# EAGLE design CamLight (EAGLE 9.4.2)
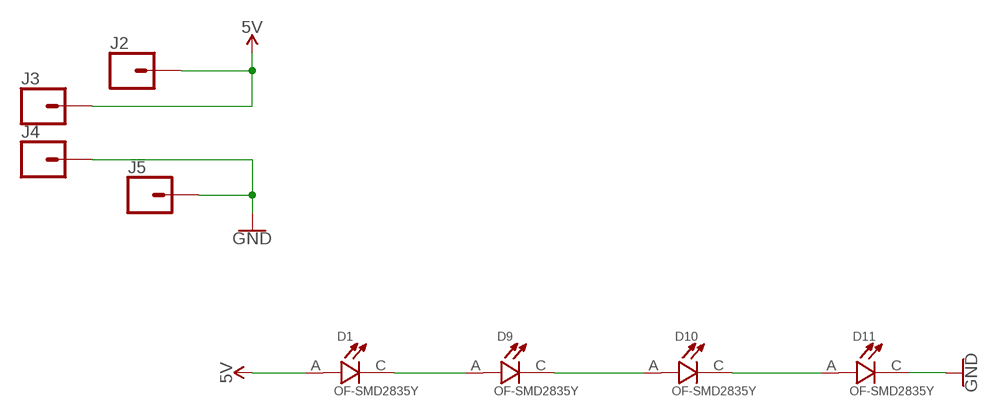
[diagram p0: schematic, sheet 1]

## Parts
D1  OF-SMD2835Y  [LED_OF-SMD2835Y]
D9  OF-SMD2835Y  [LED_OF-SMD2835Y]
D10  OF-SMD2835Y  [LED_OF-SMD2835Y]
D11  OF-SMD2835Y  [LED_OF-SMD2835Y]
J2  CONN_01  [1X01]
J3  CONN_01  [1X01]
J4  CONN_01  [1X01]
J5  CONN_01  [1X01]

## Nets
5V: D1.A J2.1 J3.1
GND: D11.C J4.1 J5.1
N$1: D10.C D11.A
N$9: D9.C D10.A
N$10: D1.C D9.A

## Library data of the parts
D1 D9-D11 = OF-SMD2835Y:OF-SMD2835Y: LED; SMD; 2835, PLCC2; yellow; 2200-2800mcd; 2.8x3.5x0.75mm; 120° Check availability <https://pricing.snapeda.com/parts/OF-SMD2835Y/Optoflash/view-part?ref=eda>; AVAILABILITY: Not in stock; CHECK_PRICES: https://www.snapeda.com/parts/OF-SMD2835Y/Optoflash/view-part/?ref=eda; DESCRIPTION: LED; SMD; 2835, PLCC2; yellow; 2200-2800mcd; 2.8x3.5x0.75mm; 120°; MF: Optoflash; MP: OF-SMD2835Y; PACKAGE: PLCC-2 Optoflash; PRICE: None; SNAPEDA_LINK: https://www.snapeda.com/parts/OF-SMD2835Y/Optoflash/view-part/?ref=snap
J2-J5 = SparkFun-Connectors:CONN_01: Single connection point. Often used as Generic Header-pin footprint for 0.1 inch spaced/style header connections On any of the 0.1 inch spaced packages, you can populate with these: Break Away Headers - Straight <https://www.sparkfun.com/products/116> (PRT-00116) Break Away Male Headers - Right Angle <https://www.sparkfun.com/products/553> (PRT-00553) Female Headers <https://www.sparkfun.com/products/115> (PRT-00115) Break Away Headers - Machine Pin <https://www.sparkfun.com/products/117> (PRT-00117) Break Away Female Headers - Swiss Machine Pin <https://www.sparkfun.com/products/743> (PRT-00743) This device is also useful as a general connection point to wire up your design to another part of your project. Our various solder wires solder well into these plated through hole pads. Hook-Up Wire - Assortment (Stranded, 22 AWG) <https://www.sparkfun.com/products/11375> (PRT-11375) Hook-Up Wire - Assortment (Solid Core, 22 AWG) <https://www.sparkfun.com/products/11367> (PRT-11367) View the entire wire category on our website here <https://www.sparkfun.com/categories/141> Special notes: SMTSO-256-ET is a "flush mount" nut for a 4-40 screw. We mostly use this on specialty testbeds; it is a nice way to connect hardware to your PCB at an adjustable hieght. Also note, the SNAP packages are for using a snappable style connector. We sell a baggie of snaps and they are also used on two LilyPad designs: Snap Assortment - 30 pack (male and female) <https://www.sparkfun.com/products/11347> (DEV-11347) LilyPad Arduino SimpleSnap <https://www.sparkfun.com/products/10941> (DEV-10941) LilyPad SimpleSnap Protoboard <https://www.sparkfun.com/products/10940> (DEV-10940)

## Board
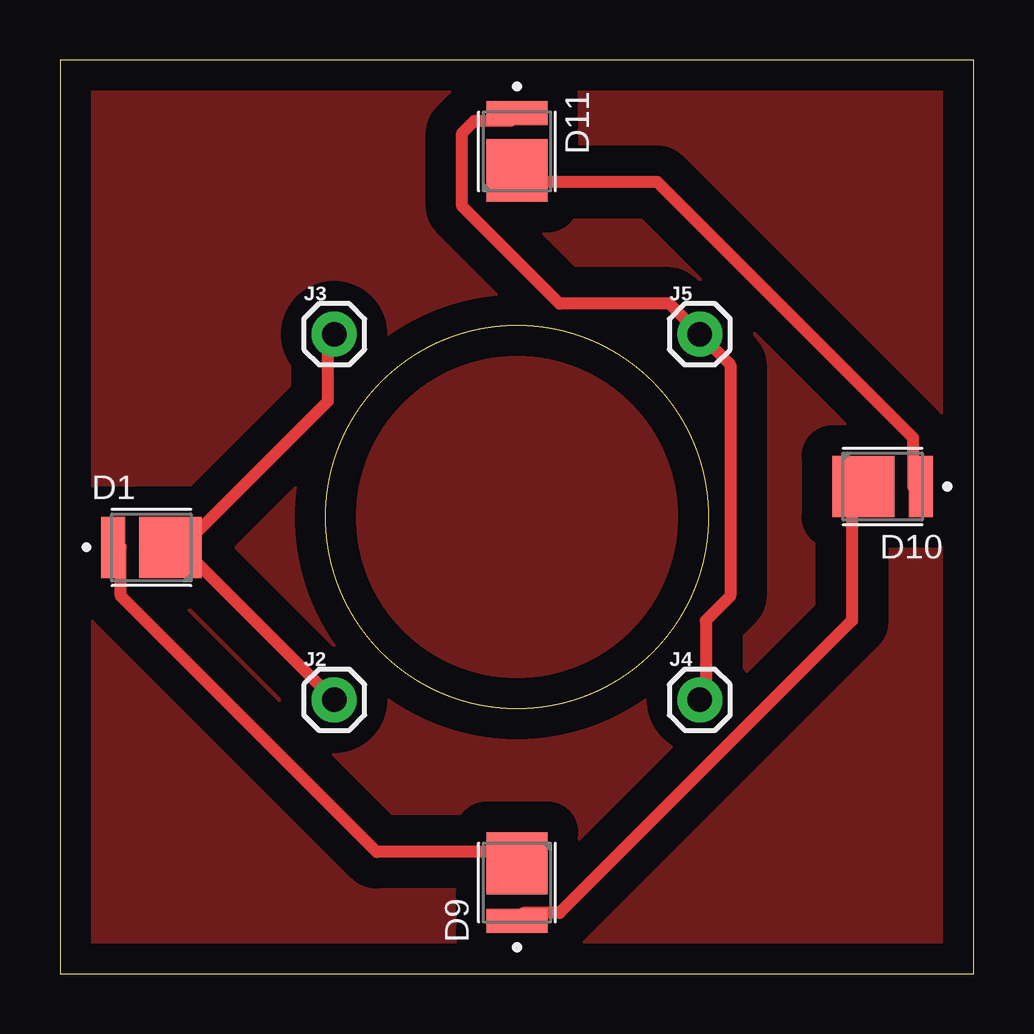
[diagram p1: board, top side]

Size 38.1 x 38.1 mm. Coordinates in mm from the lower left corner, seen from the top.
Outline: 0,0 38.1,0 38.1,38.1 0,38.1 0,0
Outline: circle at 19.05,19.05 radius 7.98
Copper layers (1*16): Top 0.035mm / dielectric 1.5mm / Bottom 0.035mm
Design rules "default *": minimum track width 20mil, minimum drill 0.5mm, track to track 20mil, track to pad 20mil, pad to pad 20mil, via to via 20mil, smd to smd 20mil, copper to edge 20mil, drill to drill 20mil, minimum pad ring 12mil, minimum via ring 12mil, stop-mask expansion 4mil, vias tented up to drill 0mil, thermal gap 10mil

### Footprints (pad centres in the part's own frame; a part is rotated, then mirrored left to right if it is on the bottom)
LED_OF-SMD2835Y = smd 2.6 x 2.55: A 0.8,0 | smd 1 x 2.55: C -1.6,0
1X01 = drill 1.016 pad 1.88: 1 0,0

### Placement (x,y rotation side)
D1  3.81,17.78 0 top
D9  19.05,3.81 90 top
D10  34.29,20.32 180 top
D11  19.05,34.29 270 top
J2  11.43,11.43 0 top
J3  11.43,26.67 0 top
J4  26.67,11.43 0 top
J5  26.67,26.67 0 top

### Tracks (layer width: path | path; a pad name or v marks a point on that pad's centre or on a via)
5V
  Top 0.508: J2.1 5.08,17.78 | 5.08,17.78 11.18,23.88 11.18,26.42 J3.1 | 5.08,17.78 D1.A
GND
  Top 0.508: D11.C 18.8,35.56 17.27,35.56 16.76,35.05 16.76,32 20.83,27.94 25.4,27.94 J5.1 27.94,25.4 27.94,15.75 26.92,14.73 26.92,11.68 J4.1
N$1
  Top 0.508: D10.C 35.56,20.32 35.56,22.35 24.89,33.02 19.3,33.02 D11.A
N$9
  Top 0.508: D9.C 19.3,2.54 20.83,2.54 33.02,14.73 33.02,20.32 D10.A
N$10
  Top 0.508: D1.C 2.54,17.78 2.54,15.75 13.21,5.08 18.8,5.08 D9.A
SIG
  pour Top (isolate 1.27): 1.27,36.83 1.27,1.27 36.83,1.27 36.83,36.83